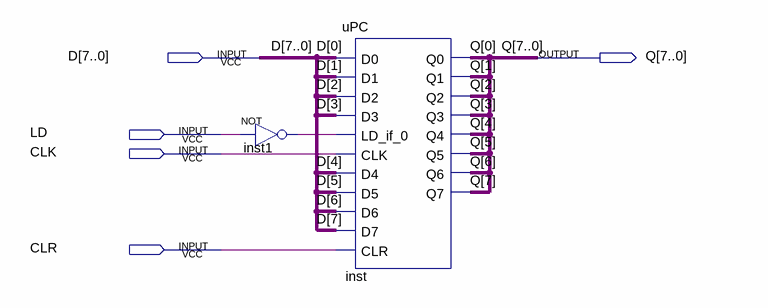
[diagram p0: schematic sheet]
// Quartus schematic counter_bus.bdf as structural Verilog: 2 symbols, 5 pins
module counter_bus (
  input  [7:0] D,
  input  LD,
  input  CLK,
  input  CLR,
  output [7:0] Q
);

  wire inst1_out;

  not inst1 (inst1_out, LD);
  uPC inst (
    .D0(D[0]), .D1(D[1]), .D2(D[2]), .D3(D[3]), .LD_if_0(inst1_out), .CLK(CLK), .D4(D[4]), .D5(D[5]),
    .D6(D[6]), .D7(D[7]), .CLR(CLR), .Q0(Q[0]), .Q1(Q[1]), .Q2(Q[2]), .Q3(Q[3]), .Q4(Q[4]), .Q5(Q[5]),
    .Q6(Q[6]), .Q7(Q[7]));
endmodule
